# EAGLE schematic Electrobrdv3 (EAGLE 7.3.0)
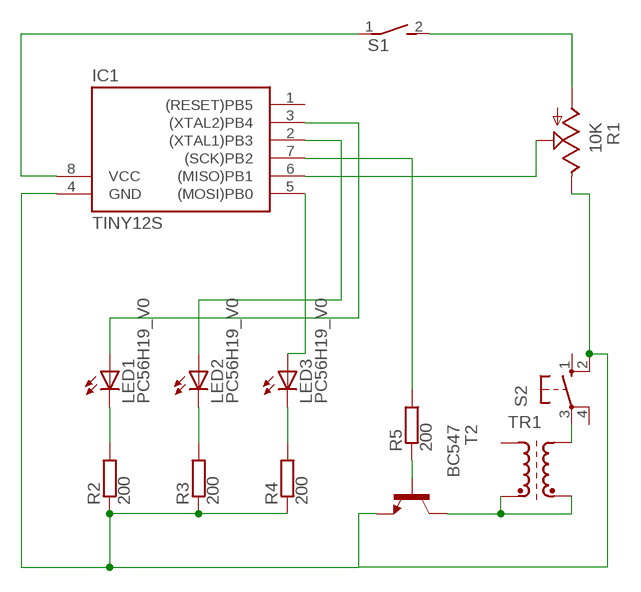
[diagram p0: schematic, sheet 1]

## Parts
IC1  TINY12S  [SOIC8]
LED1  PC56H19_V0  [PC56H19_V0]
LED2  PC56H19_V0  [PC56H19_V0]
LED3  PC56H19_V0  [PC56H19_V0]
R1  10K  TRIM_US-PTSPIN  [PT-SPIN]
R2  200  SMK  [SMK]
R3  200  SMK  [SMK]
R4  200  SMK  [SMK]
R5  200  SMK  [SMK]
S1  DS01E  [DS-01]
S2  10-XX  [B3F-10XX]
T2  BC547  [TO92]
TR1  SM-T4  [SM-T4]

## Nets
N$2: LED1.1(C) LED1.3(C) R2.1
N$3: LED2.1(C) LED2.3(C) R3.1
N$4: IC1.3((XTAL2)PB4) LED1.2(A) LED1.4(A)
N$5: IC1.7((SCK)PB2) R5.1
N$6: IC1.6((MISO)PB1) R1.S
N$7: IC1.5((MOSI)PB0) LED3.2(A) LED3.4(A)
N$8: IC1.2((XTAL1)PB3) LED2.2(A) LED2.4(A)
N$9: IC1.8(VCC) S1.1
N$10: R1.A S1.2
N$11: T2.3(C) TR1.2(E1) TR1.4(E2)
N$12: R5.2 T2.2(B)
N$13: S2.3(P) TR1.5(A2)
N$14: IC1.4(GND) R1.E R2.2 R3.2 R4.2 S2.2(S1) T2.1(E)
N$15: LED3.1(C) LED3.3(C) R4.1
Unconnected: IC1.1((RESET)PB5) S2.1(S) S2.4(P1) TR1.1(A1)

## Library data of the parts
IC1 = atmel:TINY12*: MICROCONTROLLER 1 Kbytes FLASH 64 bytes EEPROM; OC_FARNELL: unknown; OC_NEWARK: unknown
LED1-LED3 = led:PC56H19_V0: Lextar white SMD LED Source: PC56H19_20150317.pdf www.lextar.com
R1 = pot:TRIM_US-: POTENTIOMETER
R2-R5 = resistor-shunt:SMK: SMD SHUNT RESISTOR; OC_FARNELL: unknown; OC_NEWARK: unknown
S1 = switch-dil:DS01E: DIL/CODE SWITCH; OC_FARNELL: unknown; OC_NEWARK: unknown
S2 = switch-omron:10-XX: OMRON SWITCH; MPN: B3F-1000; OC_FARNELL: 176432; OC_NEWARK: 36M3542
T2 = transistor:BC547: NPN TRANSISTOR
TR1 = inductor-neosid:SM-T4: TRANSFORMER SMD wideband transformer; OC_FARNELL: unknown; OC_NEWARK: unknown